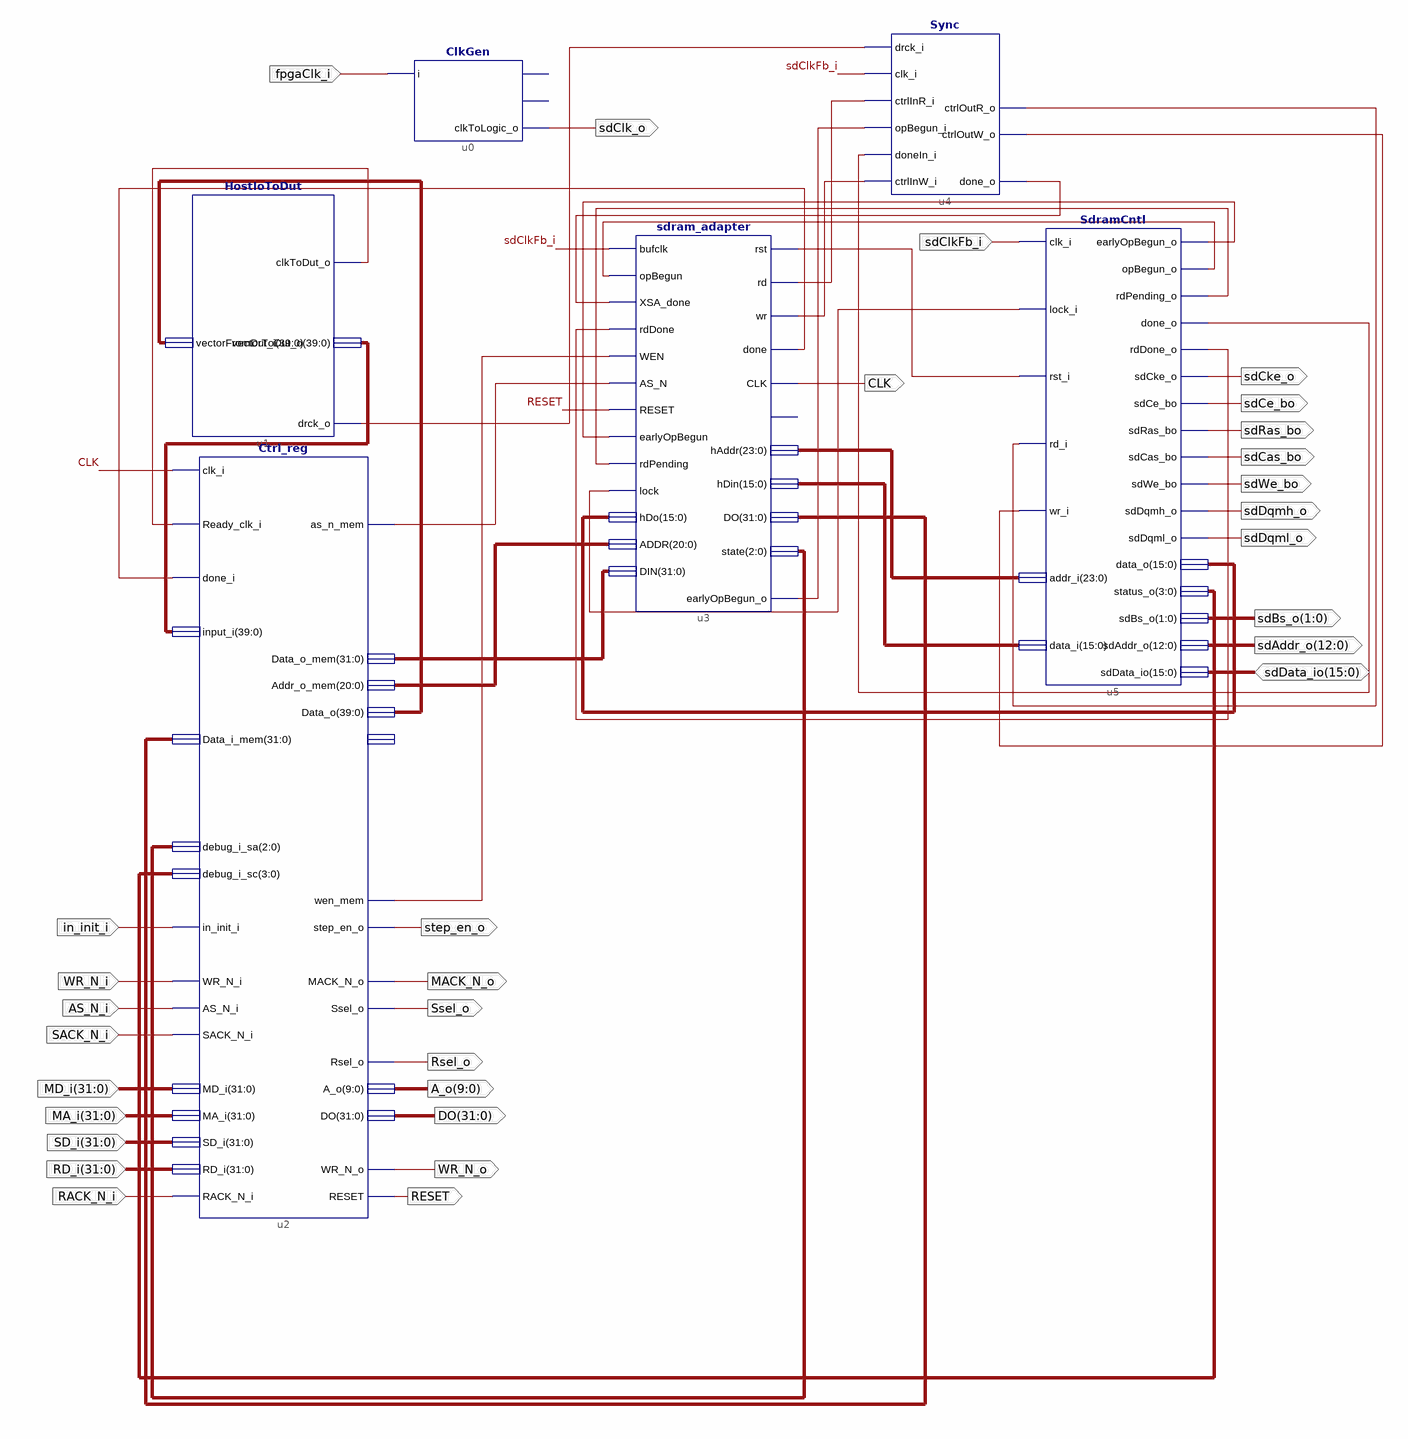
[diagram p0: schematic sheet 1]
// Xilinx ISE schematic mem_test.sch (spartan6) as structural Verilog: 6 symbols, 31 ports
module mem_test (
  input  sdClkFb_i,
  input  fpgaClk_i,
  input  in_init_i,
  input  WR_N_i,
  input  AS_N_i,
  input  SACK_N_i,
  input  [31:0] MD_i,
  input  [31:0] MA_i,
  input  [31:0] SD_i,
  input  [31:0] RD_i,
  input  RACK_N_i,
  inout  [15:0] sdData_io,
  output sdCke_o,
  output sdCe_bo,
  output sdRas_bo,
  output sdCas_bo,
  output sdWe_bo,
  output sdDqmh_o,
  output sdDqml_o,
  output [1:0] sdBs_o,
  output [12:0] sdAddr_o,
  output sdClk_o,
  output RESET,
  output CLK,
  output step_en_o,
  output MACK_N_o,
  output Ssel_o,
  output Rsel_o,
  output [9:0] A_o,
  output [31:0] DO,
  output WR_N_o
);

  wire as_n_mem, done, drck, earlyOpBegun, lock, opBegun, opBegun_i, rd, RD_i_1bit, rdDone, rdPending,
       Ready_clk, rst, sdram_done_i, sdram_done_o, wen_mem, wr, wr_i;
  wire [2:0] debug_sa;
  wire [3:0] debug_sc;
  wire [15:0] hDin, hDo;
  wire [20:0] Addr_mem;
  wire [23:0] hAddr;
  wire [31:0] Data_i_mem, Data_o_mem;
  wire [39:0] Data, input_i;

  HostIoToDut u1 (.vectorFromDut_i(Data), .clkToDut_o(Ready_clk), .drck_o(drck), .vectorToDut_o(input_i));
  Ctrl_reg u2 (
    .clk_i(CLK), .Ready_clk_i(Ready_clk), .done_i(done), .in_init_i(in_init_i), .WR_N_i(WR_N_i),
    .AS_N_i(AS_N_i), .SACK_N_i(SACK_N_i), .RACK_N_i(RACK_N_i), .input_i(input_i), .Data_i_mem(Data_i_mem),
    .MD_i(MD_i), .MA_i(MA_i), .SD_i(SD_i), .RD_i(RD_i), .debug_i_sa(debug_sa), .debug_i_sc(debug_sc),
    .as_n_mem(as_n_mem), .wen_mem(wen_mem), .RESET(RESET), .step_en_o(step_en_o), .MACK_N_o(MACK_N_o),
    .Ssel_o(Ssel_o), .WR_N_o(WR_N_o), .Rsel_o(Rsel_o), .Data_o_mem(Data_o_mem), .Addr_o_mem(Addr_mem),
    .Data_o(Data), .A_o(A_o), .DO(DO));  // open: curr_state_o
  SdramCntl u5 (
    .clk_i(sdClkFb_i), .lock_i(lock), .rst_i(rst), .rd_i(RD_i_1bit), .wr_i(wr_i), .addr_i(hAddr),
    .data_i(hDin), .sdData_io(sdData_io), .earlyOpBegun_o(earlyOpBegun), .opBegun_o(opBegun),
    .rdPending_o(rdPending), .done_o(sdram_done_i), .rdDone_o(rdDone), .sdCke_o(sdCke_o), .sdCe_bo(sdCe_bo),
    .sdRas_bo(sdRas_bo), .sdCas_bo(sdCas_bo), .sdWe_bo(sdWe_bo), .sdDqmh_o(sdDqmh_o), .sdDqml_o(sdDqml_o),
    .data_o(hDo), .status_o(debug_sc), .sdBs_o(sdBs_o), .sdAddr_o(sdAddr_o));
  sdram_adapter u3 (
    .bufclk(sdClkFb_i), .opBegun(opBegun), .XSA_done(sdram_done_o), .rdDone(rdDone), .WEN(wen_mem),
    .AS_N(as_n_mem), .RESET(RESET), .earlyOpBegun(earlyOpBegun), .rdPending(rdPending), .hDo(hDo),
    .ADDR(Addr_mem), .DIN(Data_o_mem), .lock(lock), .rst(rst), .rd(rd), .wr(wr), .done(done), .CLK(CLK),
    .hAddr(hAddr), .hDin(hDin), .DO(Data_i_mem), .state(debug_sa), .earlyOpBegun_o(opBegun_i));  // open: sdram_done
  ClkGen u0 (.i(fpgaClk_i), .clkToLogic_o(sdClk_o));  // open: o, o_b
  Sync u4 (
    .clk_i(sdClkFb_i), .ctrlInR_i(rd), .ctrlInW_i(wr), .doneIn_i(sdram_done_i), .drck_i(drck),
    .opBegun_i(opBegun_i), .done_o(sdram_done_o), .ctrlOutR_o(RD_i_1bit), .ctrlOutW_o(wr_i));
endmodule
